# EAGLE design Version 1 (EAGLE 7.3.0)
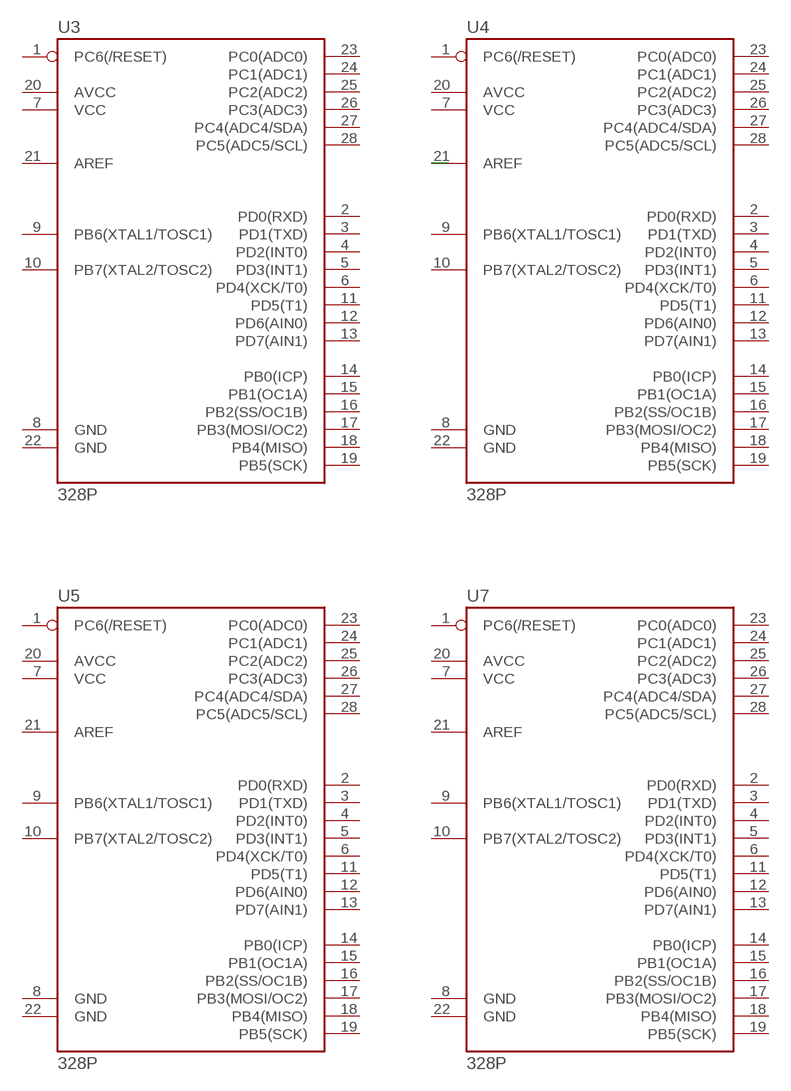
[diagram p0: schematic, sheet 1, part 1 of 2]
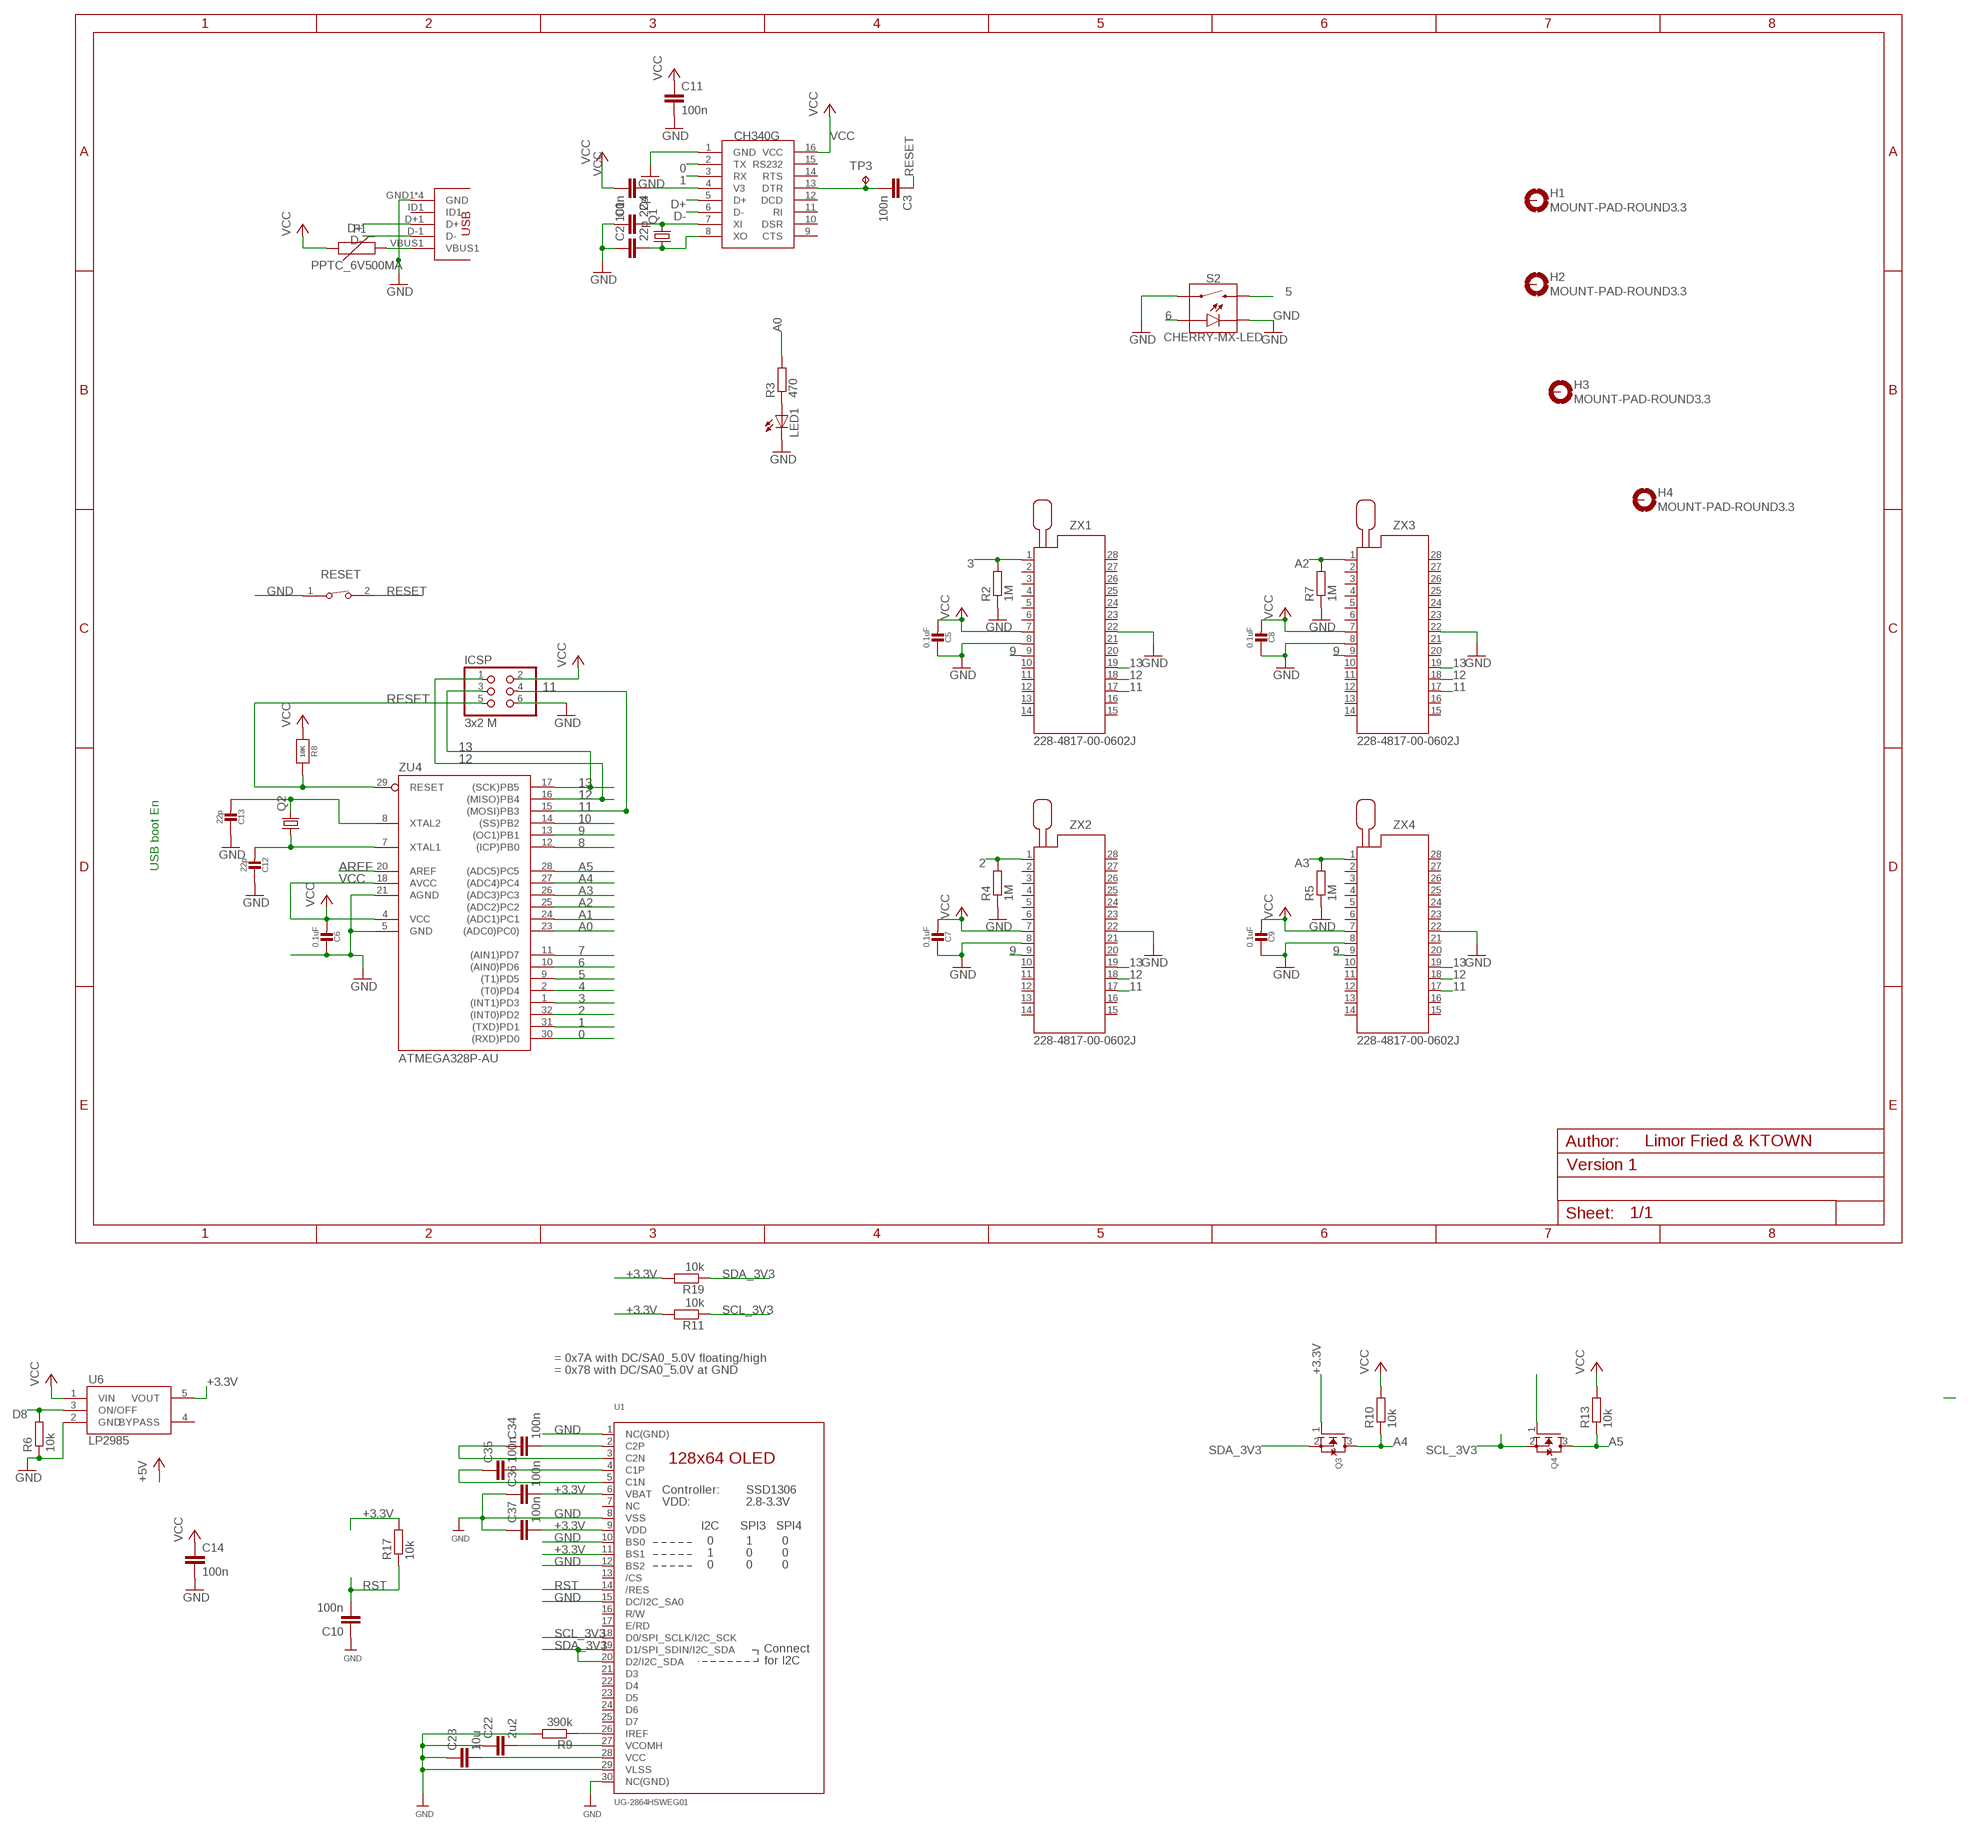
[diagram p1: schematic, sheet 1, part 2 of 2]

## Parts
C1  22p  C-EUC0805  [C0805]
C2  22p  C-EUC0805  [C0805]
C3  100n  C-EUC0805  [C0805]
C4  100n  C-EUC0805  [C0805]
C5  0.1uF  CAP_CERAMIC0805-NOOUTLINE  [0805-NO]
C6  0.1uF  CAP_CERAMIC0805-NOOUTLINE  [0805-NO]
C7  0.1uF  CAP_CERAMIC0805-NOOUTLINE  [0805-NO]
C8  0.1uF  CAP_CERAMIC0805-NOOUTLINE  [0805-NO]
C9  0.1uF  CAP_CERAMIC0805-NOOUTLINE  [0805-NO]
C10  100n  C-EUC0805  [C0805]
C11  100n  C-EUC0805  [C0805]
C12  22p  CAP_CERAMIC0805_10MGAP  [0805_10MGAP]
C13  22p  CAP_CERAMIC0805_10MGAP  [0805_10MGAP]
C14  100n  C-EUC0805  [C0805]
C22  2u2  C-EUC0805  [C0805]
C23  10u  C-EUC0805  [C0805]
C34  100n  C-EUC0805  [C0805]
C35  100n  C-EUC0805  [C0805]
C36  100n  C-EUC0805  [C0805]
C37  100n  C-EUC0805  [C0805]
F1  PPTC_6V500MA  [0805]
H1  MOUNT-PAD-ROUND3.3  [3,3-PAD]
H2  MOUNT-PAD-ROUND3.3  [3,3-PAD]
H3  MOUNT-PAD-ROUND3.3  [3,3-PAD]
H4  MOUNT-PAD-ROUND3.3  [3,3-PAD]
ICSP  3x2 M  HEADER-2X3  [2X03_ROUND_70MIL]
J1  USB-AB  [USB-AB-MICRO-SMD_V02_BOSS]
LED1  LEDCHIPLED_0805  [CHIPLED_0805]
Q1  CRYSTALHC49S  [HC49/S]
Q2  CRYSTALHC49S  [HC49/S]
Q3  MOSFET-NREFLOW  [SOT23]
Q4  MOSFET-NREFLOW  [SOT23]
R2  1M  R-EU_R0805  [R0805]
R3  470  R-EU_R0805  [R0805]
R4  1M  R-EU_R0805  [R0805]
R5  1M  R-EU_R0805  [R0805]
R6  10k  R-EU_R0805  [R0805]
R7  1M  R-EU_R0805  [R0805]
R8  10K  RESISTOR_0805MP  [_0805MP]
R9  390k  R-EU_R0805  [R0805]
R10  10k  R-EU_R0805  [R0805]
R11  10k  R-EU_R0805  [R0805]
R13  10k  R-EU_R0805  [R0805]
R17  10k  R-EU_R0805  [R0805]
R19  10k  R-EU_R0805  [R0805]
RESET  434111043826  [434111043826]
S2  CHERRY-MX-LED  [CHERRY-MX-LED]
TP3  TPTP18R  [TP18R]
U1  UG-2864HSWEG01  DISP_OLED_UG-2864HSWEG010.96"  [UG-2864HSWEG01_0.96IN_WRAPAROUND]
U2  CH340G  [SOIC16]
U3  328P  ATMEGA328P_PDIP  [DIP28]
U4  328P  ATMEGA328P_PDIP  [DIP28]
U5  328P  ATMEGA328P_PDIP  [DIP28]
U6  LP2985AIM5-3.3  [SOT25]
U7  328P  ATMEGA328P_PDIP  [DIP28]
ZU4  ATMEGA328P-AU  [TQFP32-08]
ZX1  228-4817-00-0602J  [228-4817-00-0602J]
ZX2  228-4817-00-0602J  [228-4817-00-0602J]
ZX3  228-4817-00-0602J  [228-4817-00-0602J]
ZX4  228-4817-00-0602J  [228-4817-00-0602J]

## Nets
0: U2.2(TX) ZU4.30((RXD)PD0)
1: U2.3(RX) ZU4.31((TXD)PD1)
2: R4.2 ZU4.32((INT0)PD2) ZX2.1
3: R2.2 ZU4.1((INT1)PD3) ZX1.1
4: ZU4.2((T0)PD4)
5: S2.S2 ZU4.9((T1)PD5)
6: S2.A ZU4.10((AIN0)PD6)
7: ZU4.11((AIN1)PD7)
8: ZU4.12((ICP)PB0)
9: ZU4.13((OC1)PB1) ZX1.9 ZX2.9 ZX3.9 ZX4.9
10: ZU4.14((SS)PB2)
11: ICSP.4 ZU4.15((MOSI)PB3) ZX1.17 ZX2.17 ZX3.17 ZX4.17
12: ICSP.1 ZU4.16((MISO)PB4) ZX1.18 ZX2.18 ZX3.18 ZX4.18
13: ICSP.3 ZU4.17((SCK)PB5) ZX1.19 ZX2.19 ZX3.19 ZX4.19
+3.3V: C36.2 C37.2 Q3.1(G) Q4.1(G) R11.2 R17.2 R19.2 U1.6(VBAT) U1.9(VDD) U1.11(BS1) U6.5(VOUT)
A0: R3.2 ZU4.23((ADC0)PC0))
A1: ZU4.24((ADC1)PC1)
A2: R7.2 ZU4.25((ADC2)PC2) ZX3.1
A3: R5.2 ZU4.26((ADC3)PC3) ZX4.1
A4: Q3.3(D) R10.1 ZU4.27((ADC4)PC4)
A5: Q4.3(D) R13.1 ZU4.28((ADC5)PC5)
AREF [aref]: ZU4.20(AREF)
AREF1: U4.21(AREF)
D8: R6.2 U6.3(ON/OFF)
D+: J1.D+1(D+) U2.5(D+)
D-: J1.D-1(D-) U2.6(D-)
GND [gnd]: C1.1 C2.1 C5.1 C6.1 C7.1 C8.1 C9.1 C10.1 C11.2 C12.1 C13.1 C14.2 C22.1 C23.1 C36.1 C37.1 ICSP.6 J1.GND1(GND) J1.P$1(GND) J1.P$2(GND) J1.P$3(GND) LED1.C R2.1 R4.1 R5.1 R6.1 R7.1 R9.2 RESET.1 S2.K(C) S2.S1 U1.1(NC(GND)) U1.8(VSS) U1.10(BS0) U1.12(BS2) U1.15(DC/I2C_SA0) U1.29(VLSS) U1.30(NC(GND)) U2.1(GND) U6.2(GND) ZU4.5(GND) ZU4.21(AGND) ZX1.8 ZX1.22 ZX2.8 ZX2.22 ZX3.8 ZX3.22 ZX4.8 ZX4.22
N$2: C1.2 Q1.2 U2.7(XI)
N$3: C23.2 U1.28(VCC)
N$4: C2.2 Q1.1 U2.8(XO)
N$5: C3.2 TP3.TP U2.13(DTR)
N$6: C4.1 U2.4(V3)
N$7: LED1.A R3.1
N$10: F1.2 J1.VBUS1
N$11: C34.2 U1.2(C2P)
N$19: C22.2 U1.27(VCOMH)
N$104: R9.1 U1.26(IREF)
N$112: C34.1 U1.3(C2N)
N$113: C35.2 U1.4(C1P)
N$114: C35.1 U1.5(C1N)
RESET: C3.1 ICSP.5 R8.1 RESET.2 ZU4.29(RESET)
RST: C10.2 R17.1 U1.14(/RES)
SCL_3V3: Q4.2(S) R11.1 U1.18(D0/SPI_SCLK/I2C_SCK)
SDA_3V3: Q3.2(S) R19.1 U1.19(D1/SPI_SDIN/I2C_SDA) U1.20(D2/I2C_SDA)
VCC [usbvcc]: C4.2 C5.2 C6.2 C7.2 C8.2 C9.2 C11.1 C14.1 F1.1 ICSP.2 R8.2 R10.2 R13.2 U2.16(VCC) U6.1(VIN) ZU4.4(VCC) ZU4.18(AVCC) ZX1.7 ZX2.7 ZX3.7 ZX4.7
XTAL1: C12.2 Q2.1 ZU4.7(XTAL1)
XTAL2: C13.2 Q2.2 ZU4.8(XTAL2)
Unconnected: H1.B3,3(MOUNT) H2.B3,3(MOUNT) H3.B3,3(MOUNT) H4.B3,3(MOUNT) J1.ID1 U1.7(NC) U1.13(/CS) U1.16(R/W) U1.17(E/RD) U1.21(D3) U1.22(D4) U1.23(D5) U1.24(D6) U1.25(D7) U2.9(CTS) U2.10(DSR) U2.11(RI) U2.12(DCD) U2.14(RTS) U2.15(RS232) U3.1(PC6(/RESET)) U3.2(PD0(RXD)) U3.3(PD1(TXD)) U3.4(PD2(INT0)) U3.5(PD3(INT1)) U3.6(PD4(XCK/T0)) U3.7(VCC) U3.8(GND) U3.9(PB6(XTAL1/TOSC1)) U3.10(PB7(XTAL2/TOSC2)) U3.11(PD5(T1)) U3.12(PD6(AIN0)) U3.13(PD7(AIN1)) U3.14(PB0(ICP)) U3.15(PB1(OC1A)) U3.16(PB2(SS/OC1B)) U3.17(PB3(MOSI/OC2)) U3.18(PB4(MISO)) U3.19(PB5(SCK)) U3.20(AVCC) U3.21(AREF) U3.22(GND) U3.23(PC0(ADC0)) U3.24(PC1(ADC1)) U3.25(PC2(ADC2)) U3.26(PC3(ADC3)) U3.27(PC4(ADC4/SDA)) U3.28(PC5(ADC5/SCL)) U4.1(PC6(/RESET)) U4.2(PD0(RXD)) U4.3(PD1(TXD)) U4.4(PD2(INT0)) U4.5(PD3(INT1)) U4.6(PD4(XCK/T0)) U4.7(VCC) U4.8(GND) U4.9(PB6(XTAL1/TOSC1)) U4.10(PB7(XTAL2/TOSC2)) U4.11(PD5(T1)) U4.12(PD6(AIN0)) U4.13(PD7(AIN1)) U4.14(PB0(ICP)) U4.15(PB1(OC1A)) U4.16(PB2(SS/OC1B)) U4.17(PB3(MOSI/OC2)) U4.18(PB4(MISO)) U4.19(PB5(SCK)) U4.20(AVCC) U4.22(GND) U4.23(PC0(ADC0)) U4.24(PC1(ADC1)) U4.25(PC2(ADC2)) U4.26(PC3(ADC3)) U4.27(PC4(ADC4/SDA)) U4.28(PC5(ADC5/SCL)) U5.1(PC6(/RESET)) U5.2(PD0(RXD)) U5.3(PD1(TXD)) U5.4(PD2(INT0)) U5.5(PD3(INT1)) U5.6(PD4(XCK/T0)) U5.7(VCC) U5.8(GND) U5.9(PB6(XTAL1/TOSC1)) U5.10(PB7(XTAL2/TOSC2)) U5.11(PD5(T1)) U5.12(PD6(AIN0)) U5.13(PD7(AIN1)) U5.14(PB0(ICP)) U5.15(PB1(OC1A)) U5.16(PB2(SS/OC1B)) U5.17(PB3(MOSI/OC2)) U5.18(PB4(MISO)) U5.19(PB5(SCK)) U5.20(AVCC) U5.21(AREF) U5.22(GND) U5.23(PC0(ADC0)) U5.24(PC1(ADC1)) U5.25(PC2(ADC2)) U5.26(PC3(ADC3)) U5.27(PC4(ADC4/SDA)) U5.28(PC5(ADC5/SCL)) U6.4(BYPASS) U7.1(PC6(/RESET)) U7.2(PD0(RXD)) U7.3(PD1(TXD)) U7.4(PD2(INT0)) U7.5(PD3(INT1)) U7.6(PD4(XCK/T0)) U7.7(VCC) U7.8(GND) U7.9(PB6(XTAL1/TOSC1)) U7.10(PB7(XTAL2/TOSC2)) U7.11(PD5(T1)) U7.12(PD6(AIN0)) U7.13(PD7(AIN1)) U7.14(PB0(ICP)) U7.15(PB1(OC1A)) U7.16(PB2(SS/OC1B)) U7.17(PB3(MOSI/OC2)) U7.18(PB4(MISO)) U7.19(PB5(SCK)) U7.20(AVCC) U7.21(AREF) U7.22(GND) U7.23(PC0(ADC0)) U7.24(PC1(ADC1)) U7.25(PC2(ADC2)) U7.26(PC3(ADC3)) U7.27(PC4(ADC4/SDA)) U7.28(PC5(ADC5/SCL)) ZX1.2 ZX1.3 ZX1.4 ZX1.5 ZX1.6 ZX1.10 ZX1.11 ZX1.12 ZX1.13 ZX1.14 ZX1.15 ZX1.16 ZX1.20 ZX1.21 ZX1.23 ZX1.24 ZX1.25 ZX1.26 ZX1.27 ZX1.28 ZX2.2 ZX2.3 ZX2.4 ZX2.5 ZX2.6 ZX2.10 ZX2.11 ZX2.12 ZX2.13 ZX2.14 ZX2.15 ZX2.16 ZX2.20 ZX2.21 ZX2.23 ZX2.24 ZX2.25 ZX2.26 ZX2.27 ZX2.28 ZX3.2 ZX3.3 ZX3.4 ZX3.5 ZX3.6 ZX3.10 ZX3.11 ZX3.12 ZX3.13 ZX3.14 ZX3.15 ZX3.16 ZX3.20 ZX3.21 ZX3.23 ZX3.24 ZX3.25 ZX3.26 ZX3.27 ZX3.28 ZX4.2 ZX4.3 ZX4.4 ZX4.5 ZX4.6 ZX4.10 ZX4.11 ZX4.12 ZX4.13 ZX4.14 ZX4.15 ZX4.16 ZX4.20 ZX4.21 ZX4.23 ZX4.24 ZX4.25 ZX4.26 ZX4.27 ZX4.28

## Notes on the sheet
- USB boot En
- Limor Fried & KTOWN
- = 0x7A with DC/SA0_5.0V floating/high
- = 0x78 with DC/SA0_5.0V at GND

## Library data of the parts
C1-C4 C11 C14 = resistor:C-EU: CAPACITOR, European symbol
C5-C9 C12 C13 = microbuilder:CAP_CERAMIC: Ceramic Capacitors For new designs, use the packages preceded by an '_' character since they are more reliable: The following footprints should be used on most boards: _0402 - Standard footprint for regular board layouts _0603 - Standard footprint for regular board layouts _0805 - Standard footprint for regular board layouts _1206 - Standard footprint for regular board layouts For extremely tight-pitch boards where space is at a premium, the following 'micro-pitch' footprints can be used (smaller pads, no silkscreen outline, etc.): _0402MP - Micro-pitch footprint for very dense/compact boards _0603MP - Micro-pitch footprint for very dense/compact boards _0805MP - Micro-pitch footprint for very dense/compact boards _1206MP - Micro-pitch footprint for very dense/compact boards
C10 C22 C23 C34-C37 = rcl:C-EU: CAPACITOR, European symbol
F1 = SparkFun-Fuses:PPTC: Resettable Fuse PPTC Resettable Fuse. Really a sort of resistor with a polymeric positive temperature coefficient whose resistance increases dramatically with an increase in temperature. When heated by the power passing through the resistance rises causing the current to be limited, protecting the circuit. This is achieved by the transition of the polymer from a crystalline to an amorphous state where the conductive carbon separates breaking the conductive pathways found in the cool crystalline structure. When a PPTC cools back down it resumes conducting letting the circuit turn back on. SparkFun Products: SparkFun RedBoard - Programmed with Arduino <https://www.sparkfun.com/products/12757> Pro Micro - 5V/16MHz <https://www.sparkfun.com/products/12640> Arduino Pro 328 - 5V/16MHz <https://www.sparkfun.com/products/10915> MP3 Trigger <https://www.sparkfun.com/products/13720>
H1-H4 = holes:MOUNT-PAD-ROUND: MOUNTING PAD, round
ICSP = microbuilder:HEADER-2X3: PIN HEADER
J1 = Testing:USB-AB
LED1 = adafruit:LED: LED OSRAM: - CHIPLED LG R971, LG N971, LY N971, LG Q971, LY Q971, LO R971, LY R971 LH N974, LH R974 LS Q976, LO Q976, LY Q976 LO Q996 - Hyper CHIPLED LW Q18S LB Q993, LB Q99A, LB R99A - SideLED LS A670, LO A670, LY A670, LG A670, LP A670 LB A673, LV A673, LT A673, LW A673 LH A674 LY A675 LS A676, LA A676, LO A676, LY A676, LW A676 LS A679, LY A679, LG A679 - Hyper Micro SIDELED® LS Y876, LA Y876, LO Y876, LY Y876 LT Y87S - SmartLED LW L88C, LW L88S LB L89C, LB L89S, LG L890 LS L89K, LO L89K, LY L89K LS L896, LA L896, LO L896, LY L896 - TOPLED LS T670, LO T670, LY T670, LG T670, LP T670 LSG T670, LSP T670, LSY T670, LOP T670, LYG T670 LG T671, LOG T671, LSG T671 LB T673, LV T673, LT T673, LW T673 LH T674 LS T676, LA T676, LO T676, LY T676, LB T676, LH T676, LSB T676, LW T676 LB T67C, LV T67C, LT T67C, LS T67K, LO T67K, LY T67K, LW E67C LS E67B, LA E67B, LO E67B, LY E67B, LB E67C, LV E67C, LT E67C LW T67C LS T679, LY T679, LG T679 LS T770, LO T770, LY T770, LG T770, LP T770 LB T773, LV T773, LT T773, LW T773 LH T774 LS E675, LA E675, LY E675, LS T675 LS T776, LA T776, LO T776, LY T776, LB T776 LHGB T686 LT T68C, LB T68C - Hyper Mini TOPLED® LB M676 - Mini TOPLED Santana® LG M470 LS M47K, LO M47K, LY M47K Source: http://www.osram.convergy.de/
Q1 Q2 = adafruit:CRYSTAL: CRYSTAL; OC_FARNELL: 1667008; OC_NEWARK: unknown
Q3 Q4 = adafruit:MOSFET-N: N-Channel Mosfet 2N7002E - 60V 260mA SOT23 [Digikey: 2N7002ET1GOSTR-ND] - REEL BSH103 - 30V 850mA SOT23 [Digikey: 568-5013-1-ND]
R2-R5 R7 = resistor:R-EU_: RESISTOR, European symbol
R6 R9-R11 R13 R17 R19 = rcl:R-EU_: RESISTOR, European symbol
R8 = microbuilder:RESISTOR: Resistors 0402 - 0402 Surface Mount Package 22 Ohm 1% 1/16W [Digikey: 311-22.0LRTR-ND] 33 Ohm 5% 1/16W 1.0K 5% 1/16W 1.5K 5% 1/16W 2.0K 1% 1/16W 10.0K 1% 1/16W [Digikey: 311-10.0KLRTR-ND] 10.0K 5% 1/16W [Digikey: RMCF0402JT10K0TR-ND] 12.1K 1% 1/16W [Digikey: 311-22.0LRTR-ND] 100.0K 5% 1/16W 0603 - 0603 Surface Mount Package 0 Ohm 1/10 Watt 1% Resistor 15 Ohm 1/10 Watt 1% Resistor 33 Ohm 1/10 Watt 1% Resistor 49.9 Ohm 1/10 Watt 1% Resistor 100 Ohm 1/10 Watt 1% Resistor 150 Ohm 1/10 Watt 1% Resistor 240 Ohm 1/10 Watt 1% Resistor 390 Ohm 1/10 Watt 1% Resistor 560 Ohm 1/10 Watt 1% Resistor 680 Ohm 1/10 Watt 1% Resistor 750 Ohm 1/10 Watt 1% Resistor 1.0K Ohm 1/10 Watt 1% Resistor 1.5K Ohm 1/10 Watt 1% Resistor 2.0K Ohm 1/10 Watt 1% Resistor 2.2K Ohm 1/10 Watt 1% Resistor 3.3K Ohm 1/10 Watt 1% Resistor 4.7K Ohm 1/10 Watt 1% Resistor 10.0K Ohm 1/10 Watt 1% Resistor 12.0K Ohm 1/10 Watt 1% Resistor 12.1K Ohm 1/10 Watt 1% Resistor 20.0K Ohm 1/10 Watt 1% Resistor 33.0K Ohm 1/10 Watt 1% Resistor 100.0K Ohm 1/10 Watt 1% Resistor 0805 - 0805 Surface Mount Package 0 Ohm 1/8 Watt 1% Resistor 33 Ohm 1/8 Watt 1% Resistor 100 Ohm 1/8 Watt 1% Resistor 150 Ohm 1/8 Watt 1% Resistor 200 Ohm 1/8 Watt 1% Resistor 240 Ohm 1/8 Watt 1% Resistor 330 Ohm 1/8 Watt 1% Resistor 390 Ohm 1/8 Watt 1% Resistor 470 Ohm 1/8 Watt 1% Resistor 1.0K Ohm 1/8 Watt 1% Resistor 1.5K Ohm 1/8 Watt 1% Resistor 2.0K Ohm 1/8 Watt 1% Resistor 4.7K Ohm 1/8 Watt 1% Resistor 5.1K Ohm 1/8 Watt 1% Resistor 5.6K Ohm 1/8 Watt 1% Resistor 10.0K Ohm 1/8 Watt 1% Resistor 22.0K Ohm 1/8 Watt 1% Resistor 33.0K Ohm 1/8 Watt 1% Resistor 100K Ohm 1/8 Watt 1% Resistor 1206 - 1206 Surface Mount Package 2012 - 2010 Surface Mount Package 0.11 Ohm 1/2 Watt 1% Resistor - Digikey: RHM.11UCT-ND
RESET = Eagle_SWITCHES (rev18c):434111043826: 6.0x3.5 mm SMD WS-TASV <http://katalog.we-online.de/media/images/v2/Family_WS-TASV_6.0x3.jpg> Details see: http://katalog.we-online.de/em/datasheet/4341x1xxx8x6.pdf 2015 (C) Wurth Elektronik
S2 = SparkFun-Electromechanical2:CHERRY-MX-LED: Cherry MX Switch - Electromechanical Swith w/ LED Cherry MX Keyswitches are top-of-the-line mechanical keyboard switches. They’re satisfyingly “clicky”, reliable up to tens-of-millions of key presses, and a standard in gaming and programming keyboards across the globe. This ‘blue’ version Cherry MX Switch is favored by most due to its secondary internal actuator making it less likely to “double-tap.” If you are looking for a noticeably audible and high-quality key switch, this is the perfect option for you! SparkFun Product Link <https://www.sparkfun.com/products/13834>; SF_ID: COM-13834
TP3 = testpad:TP: Test pad
U1 = microbuilder:DISP_OLED_UG-2864HSWEG01: UG-2864HSWEG01 OLED display Both 1.3" and 0.96" models share the same FPC tab footprint, only the screen dimensions vary.
U2 = ch340g:CH340G
U3-U5 U7 = SparkFun-IC-Microcontroller:ATMEGA328P_PDIP: Atmel 328P Through hole ATMEGA328P uC used in the Arduino 32kb flash, 1k EEPROM, 2k SRAM Datasheet <http://www.sparkfun.com/datasheets/Components/SMD/ATMega328.pdf> SparkFun Products Storefront component: AVR 28 Pin 20MHz 32K 6A/D - ATMega328P <https://www.sparkfun.com/products/9061> (COM-09061) SparkFun Simon Says - Through-Hole Soldering Kit <https://www.sparkfun.com/products/10547> (KIT-10547) SparkFun Learn to Solder - Simon Says <https://www.sparkfun.com/products/13708> (KIT-13708) SparkFun BigTime Watch Kit <https://www.sparkfun.com/products/11734> (KIT-11734) SparkFun ClockIt <https://www.sparkfun.com/products/10930> (KIT-10930) SparkFun Serial Enabled LCD Kit <https://www.sparkfun.com/products/10097> (LCD-10097) SparkFun Simon Tilts - Through Hole Soldering Kit <https://www.sparkfun.com/products/12634> (KIT-12634) SparkFun Frequency Counter Kit <https://www.sparkfun.com/products/10140> (KIT-10140) FabFM Radio Kit <https://www.sparkfun.com/products/11043> (KIT-11043) SparkFun Binary Blaster Kit <https://www.sparkfun.com/products/12037> (KIT-12037) SparkFun Metro-Gnome <https://www.sparkfun.com/products/9236> (KIT-09236) ATmega328 with Arduino Optiboot (Uno) <https://www.sparkfun.com/products/10524> (DEV-10524); PROD_ID: IC-09136
U6 = LP2985:LP2985: LP2985-N Micropower 150 mA Low-Noise Ultra Low-Dropout Regulator
ZU4 = SmartPrj:ATMEGA328P-: MICROCONTROLLER 4 Kbytes FLASH 128 bytes SRAM 256 bytes EEPROM UART 6-channel 10 bit ADC
ZX1-ZX4 = con-3m:228-?00-0602J: Zero Insertion Force Socked Source: http://www.3M.com/ehpd; MF: 3M; MPN: 228-4817-00-0602J; OC_FARNELL: 1252775; OC_NEWARK: 85K7834

## Net classes
0 default: clearance 0.205 mm
1 power: width 0.305 mm, drill 0.483 mm, clearance 0.203 mm
2 gnd: width 0.305 mm, drill 0.483 mm, clearance 0.203 mm
3 usbvcc: width 0.305 mm, drill 0.483 mm, clearance 0.203 mm
4 aref: width 0.254 mm, drill 0.483 mm, clearance 0.203 mm

## Board
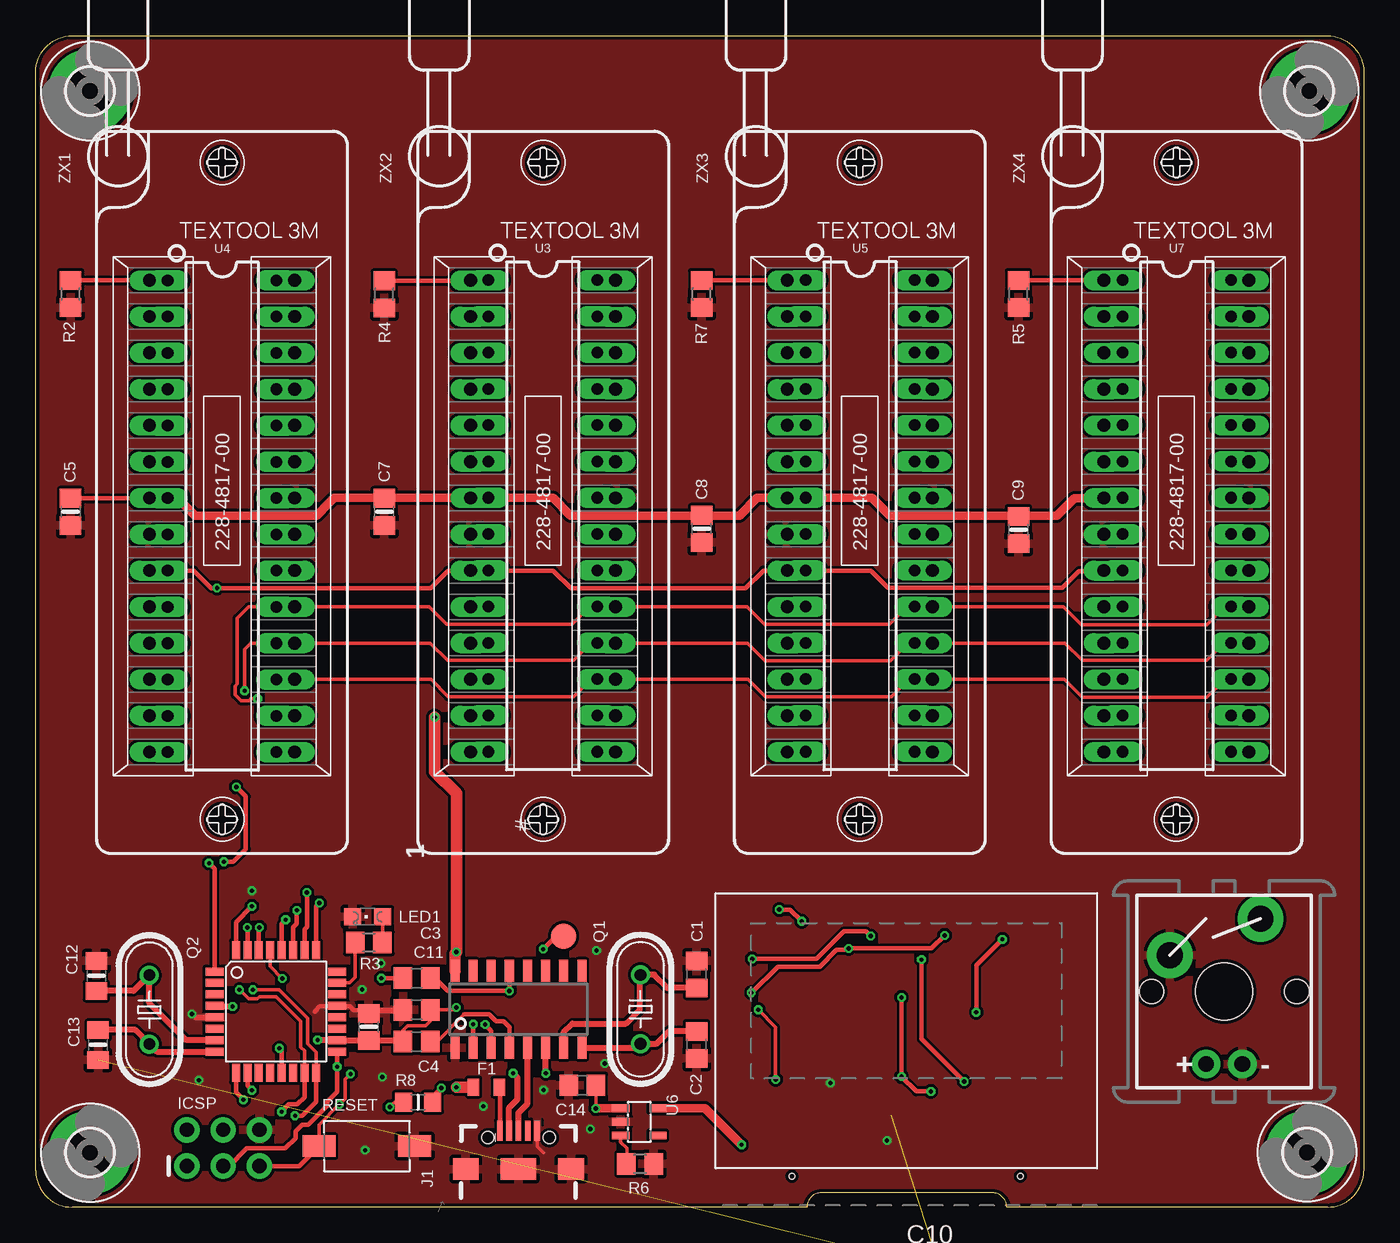
[diagram p2: board, top side]
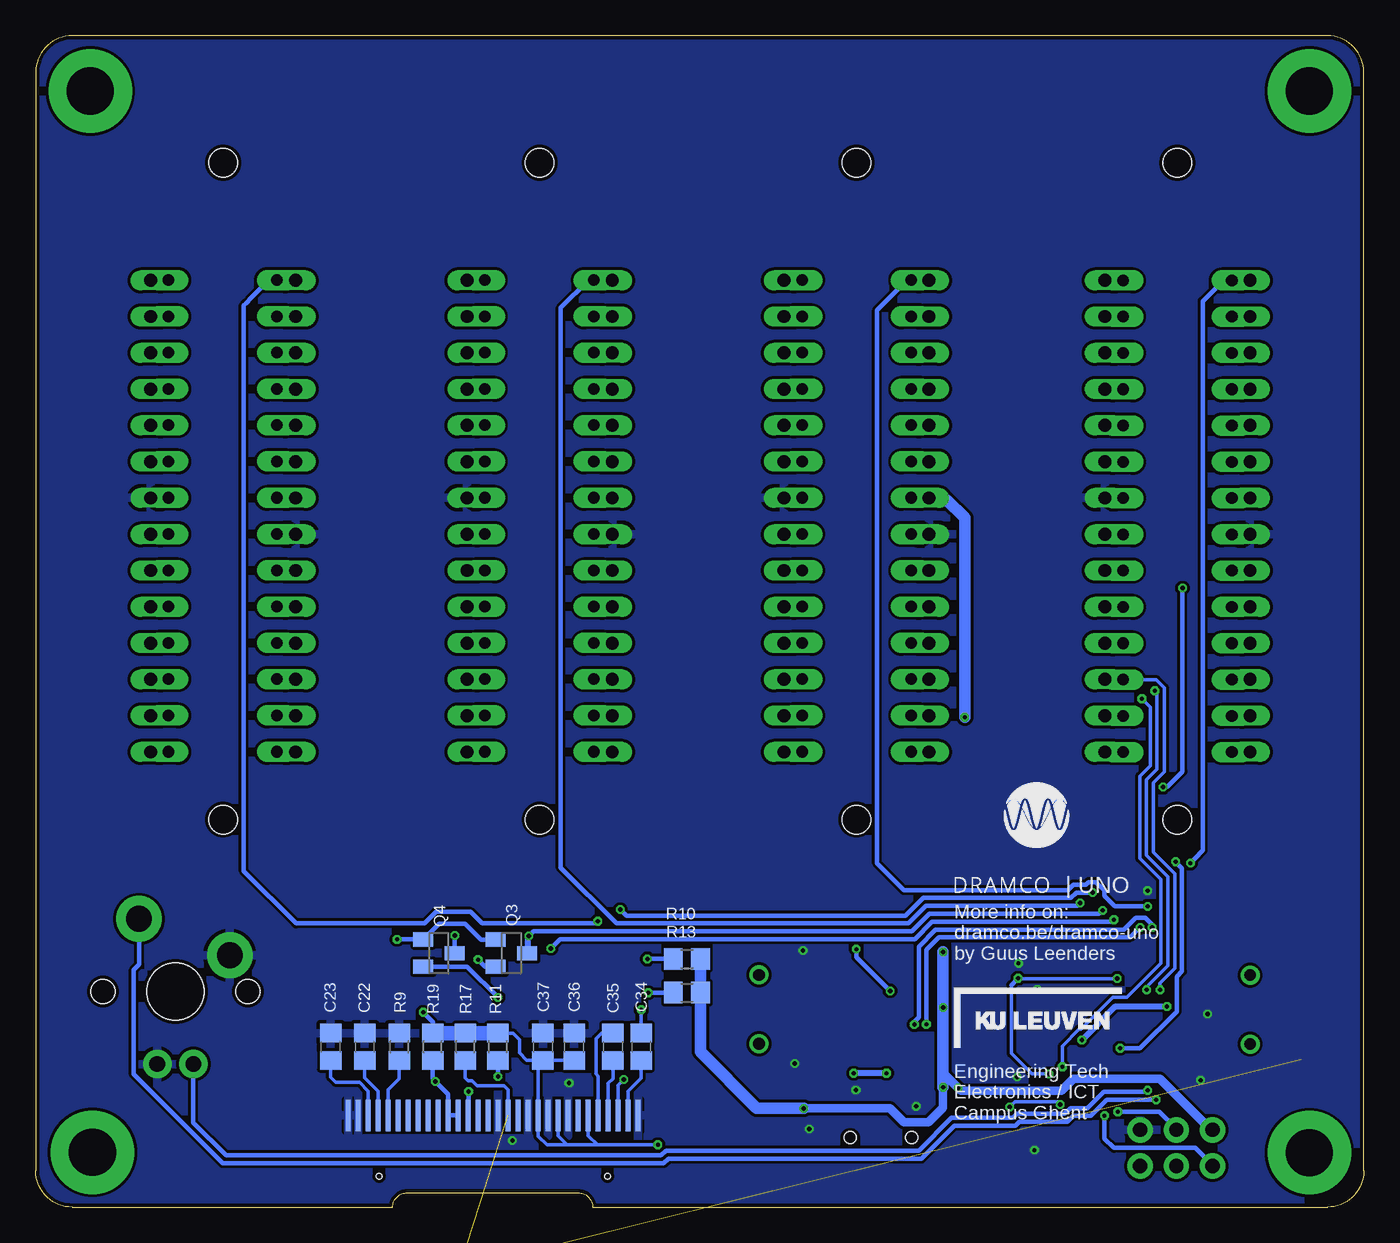
[diagram p3: board, bottom side, seen from below]

Size 93 x 82 mm. Coordinates in mm from the lower left corner, seen from the top.
Outline: 0,2.54 0,79.46 arc-90 2.54,82 90.46,82 arc-90 93,79.46 93,2.54 arc-90 90.46,0 68,0 arc90 67,1 55,1 arc90 54,0 2.54,0 arc-90 0,2.54
Copper layers (1*16): Top 0.035mm / dielectric 1.5mm / Bottom 0.035mm
Design rules "SeeedStudio_2layer_DRU_no_angle_20140221": minimum track width 6mil, minimum drill 12mil, track to track 6mil, track to pad 6mil, pad to pad 6mil, via to via 6mil, smd to smd 0mil, copper to edge 10mil, drill to drill 10mil, minimum pad ring 10mil, minimum via ring 6mil, stop-mask expansion 2mil, vias tented up to drill 100mil, thermal gap 10mil

### Footprints (pad centres in the part's own frame; a part is rotated, then mirrored left to right if it is on the bottom)
C0805 = smd 1.3 x 1.5: 1 -0.95,0; 2 0.95,0
0805-NO = smd 1.3 x 1.5: 1 -0.95,0; 2 0.95,0
0805_10MGAP = smd 1.2 x 1.5: 1 -1.05,0; 2 1.05,0
0805 = smd 0.8 x 1.2: 1 -0.9,0; 2 0.9,0
3,3-PAD = drill 3.3 pad 5.842: B3,3 0,0
2X03_ROUND_70MIL = drill 1 pad 1.778: 1 -2.54,-1.27; 2 -2.54,1.27; 3 0,-1.27; 4 0,1.27; 5 2.54,-1.27; 6 2.54,1.27
USB-AB-MICRO-SMD_V02_BOSS = smd 1.4 x 0.4: D+1 2.7,0; D-1 2.7,0.65; GND1 2.7,-1.3; ID1 2.7,-0.65; VBUS1 2.7,1.3 | smd 1.5 x 2.5: P$1 0,0 | smd 1.5 x 1.8: P$2 0,-3.683; P$3 0,3.683 | hole 0.85: 2.2,2.154; 2.2,-2.154
CHIPLED_0805 = smd 1.2 x 1.2: A 0,-1.05; C 0,1.05
HC49/S = drill 0.813: 1 -2.413,0; 2 2.413,0
SOT23 = smd 1 x 1.4: 1 -0.95,-1.1; 2 0.95,-1.1; 3 0,1.1
R0805 = smd 1.3 x 1.5: 1 -0.95,0; 2 0.95,0
_0805MP = smd 1.2 x 1.3: 1 -1.016,0; 2 1.016,0
434111043826 = smd 2.3 x 1.5: 1 -3.35,0; 2 3.35,0
CHERRY-MX-LED = drill 1.1 pad 2: A -1.27,-5.08; K 1.27,-5.08 | drill 1.8 pad 3.2: S1 -3.81,2.54; S2 2.54,5.08 | hole 4: 0,0 | hole 1.7: -5.08,0; 5.08,0
TP18R = smd 1.8 x 1.8: TP 0,0
UG-2864HSWEG01_0.96IN_WRAPAROUND = smd 0.35 x 2.2 bottom: 1 -10.15,-1.2; 2 -9.45,-1.2; 3 -8.75,-1.2; 4 -8.05,-1.2; 5 -7.35,-1.2; 6 -6.65,-1.2; 7 -5.95,-1.2; 8 -5.25,-1.2; 9 -4.55,-1.2; 10 -3.85,-1.2; 11 -3.15,-1.2; 12 -2.45,-1.2; 13 -1.75,-1.2; 14 -1.05,-1.2; 15 -0.35,-1.2; 16 0.35,-1.2; 17 1.05,-1.2; 18 1.75,-1.2; 19 2.45,-1.2; 20 3.15,-1.2; 21 3.85,-1.2; 22 4.55,-1.2; 23 5.25,-1.2; 24 5.95,-1.2; 25 6.65,-1.2; 26 7.35,-1.2; 27 8.05,-1.2; 28 8.75,-1.2; 29 9.45,-1.2; 30 10.15,-1.2 | hole 0.4: -8,-5.45; 8,-5.45
SOIC16 = smd 0.635 x 1.524: 1 -4.445,-2.695; 2 -3.175,-2.695; 3 -1.905,-2.695; 4 -0.635,-2.695; 5 0.635,-2.695; 6 1.905,-2.695; 7 3.175,-2.695; 8 4.445,-2.695; 9 4.445,2.695; 10 3.175,2.695; 11 1.905,2.695; 12 0.635,2.695; 13 -0.635,2.695; 14 -1.905,2.695; 15 -3.175,2.695; 16 -4.445,2.695
DIP28 = drill 0.813 pad 1.422 long: 1 -16.51,-3.81; 2 -13.97,-3.81; 3 -11.43,-3.81; 4 -8.89,-3.81; 5 -6.35,-3.81; 6 -3.81,-3.81; 7 -1.27,-3.81; 8 1.27,-3.81; 9 3.81,-3.81; 10 6.35,-3.81; 11 8.89,-3.81; 12 11.43,-3.81; 13 13.97,-3.81; 14 16.51,-3.81; 15 16.51,3.81; 16 13.97,3.81; 17 11.43,3.81; 18 8.89,3.81; 19 6.35,3.81; 20 3.81,3.81; 21 1.27,3.81; 22 -1.27,3.81; 23 -3.81,3.81; 24 -6.35,3.81; 25 -8.89,3.81; 26 -11.43,3.81; 27 -13.97,3.81; 28 -16.51,3.81
SOT25 = smd 0.55 x 1.2: 1 -0.95,-1.3; 2 0,-1.3; 3 0.95,-1.3; 4 0.95,1.3; 5 -0.95,1.3
TQFP32-08 = smd 1.27 x 0.559: 1 -4.293,2.8; 2 -4.293,2; 3 -4.293,1.2; 4 -4.293,0.4; 5 -4.293,-0.4; 6 -4.293,-1.2; 7 -4.293,-2; 8 -4.293,-2.8; 17 4.293,-2.8; 18 4.293,-2; 19 4.293,-1.2; 20 4.293,-0.4; 21 4.293,0.4; 22 4.293,1.2; 23 4.293,2; 24 4.293,2.8 | smd 0.559 x 1.27: 9 -2.8,-4.293; 10 -2,-4.293; 11 -1.2,-4.293; 12 -0.4,-4.293; 13 0.4,-4.293; 14 1.2,-4.293; 15 2,-4.293; 16 2.8,-4.293; 25 2.8,4.293; 26 2,4.293; 27 1.2,4.293; 28 0.4,4.293; 29 -0.4,4.293; 30 -1.2,4.293; 31 -2,4.293; 32 -2.8,4.293
228-4817-00-0602J = drill 0.9 long: 1 -16.51,-5.08; 2 -13.97,-5.08; 3 -11.43,-5.08; 4 -8.89,-5.08; 5 -6.35,-5.08; 6 -3.81,-5.08; 7 -1.27,-5.08; 8 1.27,-5.08; 9 3.81,-5.08; 10 6.35,-5.08; 11 8.89,-5.08; 12 11.43,-5.08; 13 13.97,-5.08; 14 16.51,-5.08; 15 16.51,5.08; 16 13.97,5.08; 17 11.43,5.08; 18 8.89,5.08; 19 6.35,5.08; 20 3.81,5.08; 21 1.27,5.08; 22 -1.27,5.08; 23 -3.81,5.08; 24 -6.35,5.08; 25 -8.89,5.08; 26 -11.43,5.08; 27 -13.97,5.08; 28 -16.51,5.08 | hole 2: 21.24,0; -24.74,0

### Placement (x,y rotation side)
C1  46.28,16.29 270 top
C2  46.28,11.36 90 top
C3  26.67,16.03 0 top
C4  26.67,11.59 180 top
C5  2.44,48.67 90 top
C6  23.32,12.61 270 top
C7  24.4,48.67 90 top
C8  46.63,47.48 90 top
C9  68.82,47.41 90 top
C10  62.23,-3.81 0 top  (outside the outline)
C11  26.67,13.81 180 top
C12  4.25,16.18 270 top
C13  4.36,11.35 90 top
C14  38.28,8.53 180 top
C22  69.95,11.23 270 bottom
C23  72.34,11.23 270 bottom
C34  50.6,11.23 270 bottom
C35  52.58,11.23 270 bottom
C36  55.3,11.23 270 bottom
C37  57.48,11.23 270 bottom
F1  31.55,8.4 0 top
H1  89.03,3.84 0 top
H2  3.81,78.13 0 top
H3  89.18,78.13 0 top
H4  3.81,3.81 0 top
ICSP  13.13,4.14 0 top
J1  33.8,2.66 90 top
LED1  23.24,20.33 90 top
Q1  42.35,13.85 90 top
Q2  7.96,13.82 270 top
Q3  59.69,17.78 270 bottom
Q4  64.77,17.78 270 bottom
R2  2.44,63.92 90 top
R3  23.33,18.52 180 top
R4  24.4,63.9 90 top
R5  68.82,63.92 90 top
R6  42.32,3.02 180 top
R7  46.63,63.92 90 top
R8  26.77,7.34 0 top
R9  67.54,11.23 90 bottom
R10  47.4,17.37 0 bottom
R11  60.63,11.23 90 bottom
R13  47.4,15.01 0 bottom
R17  62.92,11.23 90 bottom
R19  65.2,11.23 90 bottom
RESET  23.19,4.27 180 top
S2  83.22,15.1 0 top
TP3  36.95,18.95 0 top
U1  60.96,7.62 0 top
U2  33.8,13.85 0 top
U3  35.51,48.39 270 top
U4  13.06,48.36 270 top
U5  57.73,48.39 270 top
U6  42.27,5.97 270 top
U7  79.91,48.39 270 top
ZU4  16.83,13.69 0 top
ZX1  13.05,48.37 270 top
ZX2  35.53,48.37 270 top
ZX3  57.7,48.37 270 top
ZX4  79.88,48.37 270 top

### Tracks (layer width: path | path; a pad name or v marks a point on that pad's centre or on a via)
0  (via drill 0.3)
  Top 0.305: U2.2 v30.62,12.79 v30.63,12.8 | ZU4.30 15.62,19.53 v15.67,19.58
  Bottom 0.305: v30.63,12.8 30.63,18.01 29.74,18.9 16.36,18.9 v15.67,19.58
1  (via drill 0.3)
  Top 0.305: U2.3 31.89,12.35 v31.47,12.78 | v14.83,19.58 ZU4.31
  Bottom 0.305: v31.47,12.78 31.47,12.98 31.17,13.28 31.17,18.24 30,19.41 29.57,19.41 29.54,19.43 16.84,19.43 16.82,19.41 15.95,20.27 15.29,20.27 14.83,19.81 v14.83,19.58
2  (via drill 0.3)
  Top 0.305: ZU4.32 14.03,19.94 v15.14,21.06 | R4.2 30.42,64.85 ZX2.1
  Bottom 0.305: v15.14,21.06 17.42,21.06 18.16,21.79 18.16,22.17 18.75,22.76 19.28,22.76 19.46,22.58 20.34,22.58 20.73,22.2 32.21,22.2 34.09,24.08 34.09,62.79 33.43,63.45 33.07,63.8 32.03,64.85 30.49,64.85 ZX2.1
3  (via drill 0.3)
  Top 0.305: ZU4.1 12.53,23.69 v12.14,24.08 | R2.2 ZX1.1
  Bottom 0.305: v12.14,24.08 11.56,24.66 11.56,24.69 11.28,24.97 11.28,63.42 9.8,64.9 7.98,64.9 ZX1.1
5  (via drill 0.3)
  Top 0.305: ZU4.9 14.03,8.05 v14.55,7.52
  Bottom 0.305: v14.55,7.52 18.01,7.52 19.13,6.4 20.34,6.4 20.75,5.99 24.11,5.99 24.38,5.71 28.65,5.71 30.96,3.4 48.69,3.4 49.02,3.07 79.91,3.07 86.13,9.3 86.13,16.61 85.75,16.99 S2.S2
6  (via drill 0.3)
  Top 0.305: ZU4.10 14.83,8.49 v15.14,8.18
  Bottom 0.305: v15.14,8.18 15.24,8.08 18.21,8.08 19.36,6.93 20.55,6.93 20.95,6.53 24.31,6.53 24.59,6.25 28.88,6.25 31.17,3.96 48.87,3.96 49.2,3.63 79.68,3.63 81.97,5.92 81.97,10 S2.A
9  (via drill 0.3)
  Top 0.305: ZU4.13 17.23,10.97 v17.07,11.12 | v13.18,24.18 13.82,24.18 14.71,25.07 14.71,28.75 v14.05,29.41 | ZX1.9 11.07,44.55 12.29,43.33 v12.7,43.33 27.64,43.33 28.86,44.56 ZX2.9 36.24,44.56 37.49,43.31 49.71,43.31 50.95,44.55 ZX3.9 58.49,44.56 59.69,43.36 71.88,43.36 73.05,44.53 74.76,44.53 ZX4.9
  Bottom 0.305: v17.07,11.12 15.67,11.12 13.11,13.69 13.11,16.13 12.72,16.51 12.72,23.72 v13.18,24.18 | ZX1.9 | v14.05,29.41 13.77,29.41 12.7,30.48 v12.7,43.33
11  (via drill 0.3)
  Top 0.254: ZU4.15 18.83,10.94 18.57,11.2 18.57,13.01 16.84,14.73 15.67,14.73 15.52,14.58 14.91,14.58 v14.28,15.21 | ZX1.17 27.68,36.94 28.88,35.74 37.67,35.74 38.86,36.93 ZX2.17 49.88,36.94 51.1,35.71 59.92,35.71 61.14,36.93 ZX3.17 72.03,36.94 73.28,35.69 82.02,35.69 83.26,36.93 84.95,36.93 ZX4.17
  Top 0.305: ICSP.4 13.13,5.43 | ZU4.15 18.82,7.7 18.31,7.19 17.73,7.19 v17.22,6.68
  Bottom 0.254: v14.28,15.21 14.28,15.67 13.23,16.71 13.23,23.34 14.73,24.84 14.73,29.72 13.97,30.48 13.97,36.37 14.53,36.93 18.12,36.93 ZX1.17
  Bottom 0.305: v17.22,6.68 14.3,6.68 13.13,5.51 ICSP.4
12  (via drill 0.3)
  Top 0.254: ZU4.16 19.63,10.85 19.05,11.43 19.05,13.21 17.04,15.21 v15.21,15.21 | ZX4.18 84.95,39.47 83.19,39.47 81.99,38.28 73.28,38.28 72.08,39.48 ZX3.18 61.06,39.47 59.84,38.25 51.05,38.25 49.83,39.48 ZX2.18 40.6,39.5 38.89,39.5 37.67,38.28 28.83,38.28 27.63,39.48 ZX1.18 18.12,39.47 15.04,39.47 14.63,39.06 v14.63,36.14
  Top 0.305: v18.16,6.4 18.64,6.4 19.63,7.39 ZU4.16
  Bottom 0.254: v15.21,15.21 15.21,15.39 13.72,16.89 13.72,23.14 15.21,24.64 15.21,29.92 14.48,30.66 14.48,35.99 v14.63,36.14
  Bottom 0.305: ICSP.1 10.59,2.92 11.81,4.14 17.5,4.14 18.16,4.8 v18.16,6.4
13  (via drill 0.3)
  Top 0.254: ZU4.17 v21.12,9.84 v21.11,9.83 | ZX4.19 84.95,42.01 83.24,42.01 81.99,40.77 73.23,40.77 71.97,42.02 ZX3.19 61.01,42.01 59.79,40.79 51.03,40.79 49.8,42.02 ZX2.19 38.76,42.01 37.54,40.79 28.78,40.79 27.55,42.02 ZX1.19 18.12,42.01 14.91,42.01 14.12,41.22 14.12,36.63 13.97,36.47 13.97,35.87 14.38,35.46 14.94,35.46 15.06,35.59 v15.54,35.59
  Top 0.305: ICSP.3 13.54,2.87 14.78,4.12 17.48,4.12 18.19,4.83 18.19,5.31 18.64,5.77 19.07,5.77 20.42,7.11 20.42,7.39 21.11,8.08 v21.11,9.83 21.11,10.88 ZU4.17
  Bottom 0.254: v21.11,9.83 21.11,11.28 19.94,12.45 19.81,12.45 17.58,14.68 16.59,14.68 14.2,17.07 14.2,22.94 15.7,24.43 15.7,30.15 14.96,30.89 14.96,35 v15.54,35.59 | 16.64,42.01 18.12,42.01 ZX1.19
+3.3V  (via drill 0.3)
  Top 0.305: v65.86,13.64 65.86,16.92 v67.69,18.75
  Top 0.61: U6.5 46.88,6.92 v49.43,4.37
  Bottom 0.254: v49.43,4.37 53.67,4.37 | 53.67,4.37 55.78,4.37 | 55.78,4.37 57.2,4.37 57.81,4.98 U1.11 | U1.11 | U1.9 56.41,5 55.78,4.37 | U1.6 54.31,5.01 53.67,4.37 | U1.11 57.81,9.95 C37.2 | C36.2 C37.2 | R11.2 59.57,12.18 59.13,11.73 59.13,10.79 58.62,10.29 C37.2
  Bottom 0.305: R11.2 65.11,12.18 65.18,12.12 65.18,12.95 v65.86,13.64 | v67.69,18.75 65.89,18.75 Q4.1 64.76,19.84 62.92,19.84 61.81,18.73 Q3.1
  Bottom 1.016: R11.2 R17.2 R19.2
A0
  Top 0.254: ZU4.23 21.97,15.69 22.38,16.1 R3.2
A2  (via drill 0.3)
  Top 0.305: ZU4.25 19.63,21.05 v19.86,21.29 | R7.2 ZX3.1
  Bottom 0.305: v19.86,21.29 20.07,21.08 30.66,21.08 31.88,19.86 52.32,19.86 56.24,23.77 56.24,62.94 54.28,64.9 52.64,64.9 ZX3.1
A3  (via drill 0.3)
  Top 0.305: ZU4.26 18.83,19.46 19,19.63 v19,22.02 | v52.07,20.83 52.83,20.83 v53.65,20.02 | R5.2 ZX4.1
  Bottom 0.305: v19,22.02 20.14,22.02 20.52,21.64 30.84,21.64 32.08,20.4 51.64,20.4 v52.07,20.83 | v53.65,20.02 53.8,19.86 61.75,19.86 62.56,20.68 64.97,20.68 65.76,19.89 74.75,19.89 74.78,19.86 78.44,23.52 78.44,63.12 78.31,63.25 77.83,63.73 76.66,64.9 74.81,64.9 ZX4.1
A4  (via drill 0.3)
  Top 0.305: ZU4.27 18.03,19.57 18.29,19.84 v18.29,20.78 | v50.16,17.37 54.66,17.37 56.59,19.3 58.14,19.3 v58.47,18.97
  Bottom 0.305: v18.29,20.78 18.54,20.52 30.43,20.52 31.65,19.3 58.14,19.3 v58.47,18.97 | R10.1 v50.16,17.37 | v58.47,18.97 58.6,18.85 Q3.3 58.47,17.9 v58.47,18.97
A5  (via drill 0.3)
  Top 0.305: ZU4.28 17.23,19.84 v17.5,20.12 | v63.65,19.02 62.74,18.11 v56.92,18.11 56.82,18.01 56.08,18.01 54.91,16.84 51.97,16.84 50.14,15.01 v50.11,15.01
  Bottom 0.305: v17.5,20.12 17.65,19.96 30.23,19.96 31.45,18.75 56.29,18.75 v56.92,18.11 | v63.65,19.02 63.65,17.8 Q4.3 | R13.1 v50.11,15.01
D8
  Top 0.254: U6.3 40.97,4.55 41.4,4.12 41.4,3.06 R6.2
D+
  Top 0.406: J1.D+1 33.8,6.6 34.44,7.24 34.44,11.15 U2.5
D-  (via drill 0.3)
  Top 0.406: J1.D-1 33.15,6.96 33.73,7.54 33.73,9.07 v33.43,9.37 | v35.71,9.37 35.71,11.15 U2.6
  Bottom 0.406: v33.43,9.37 v35.71,9.37
GND  (via drill 0.3)  (1 unrouted)
  Top 0.254: ZU4.21 21.16,14.05 | J1.GND1 35.1,4.27 35.56,3.81
  Top 0.305: 19.53,13.69 19.89,14.05 21.16,14.05 22.02,14.05 22.28,13.79 23.33,13.79
  Top 0.406: ZU4.5 12.5,13.26 11.21,13.26 | 23.33,13.79 25.7,13.79 C11.2
  other vias: 22.86,15.24 24.28,9.12 11.43,8.89 24.18,17.07 23.06,3.99 31.34,7.06 35.56,8.2 39.85,10.06 39.27,17.96 38.84,5.46 10.95,13.51 15.14,22.15 55.65,8.69 59.61,4.67
  pour Top: 0,0 0,82.95 93,82.95 93,0
  pour Bottom: 94,0 93,82.95 0,82.95 0,0
N$2
  Top 0.406: C1.2 44.23,15.34 43.3,16.27 Q1.2 42.32,16.23 42.32,13.84 41.33,12.85 37.59,12.85 36.98,12.23 U2.7
N$3
  Bottom 0.254: U1.28 69.71,8.12 70.33,8.74 71.98,8.74 72.34,9.09 C23.2
N$4
  Top 0.406: C2.2 44.34,12.31 43.43,11.4 42.38,11.4 Q1.1 42.07,11.15 U2.8
N$5  (via drill 0.3)
  Top 0.305: TP3.TP 36.42,18.95 v35.53,18.06 | U2.13 33.17,16.54 v33.17,15.14 28.85,15.14 27.96,16.03 C3.2
  Bottom 0.305: v35.53,18.06 35.53,17.5 v33.17,15.14
N$6
  Top 0.254: C4.1 28.1,11.59 30,13.49 | U2.4 33.16,12.24 33.18,12.25
  Top 0.305: 30,13.49 31.74,13.49 32.23,13.01 32.77,13.01 33.16,12.61 33.16,12.24
  Top 0.406: C4.1
N$7
  Top 0.254: R3.1 LED1.A
N$10
  Top 0.305: J1.VBUS1 32.5,8.36 F1.2
N$11
  Bottom 0.254: U1.2 51.51,8.1 50.6,9.02 C34.2
N$19
  Bottom 0.254: U1.27 69.01,8.13 69.95,9.07 C22.2
N$104
  Bottom 0.254: U1.26 68.31,8.22 67.54,8.99 R9.1
N$112  (via drill 0.3)
  Top 0.254: v51.82,8.94 51.82,12.6 v50.6,13.82
  Bottom 0.254: U1.3 52.21,8.55 v51.82,8.94 | v50.6,13.82 C34.1
N$113
  Bottom 0.254: U1.4 52.91,8.66 52.58,8.99 C35.2
N$114
  Bottom 0.254: U1.5 53.61,9.16 53.77,9.32 53.77,11.79 53.39,12.17 52.59,12.17 C35.1
RESET  (via drill 0.3)
  Top 0.254: RESET.2 19.84,5.77 v21.26,7.19 21.67,7.59 21.67,8.94 v22.05,9.32 | ZU4.29 16.43,16.85 v17.27,16 | R8.1 25.12,7.34 v24.79,7.01
  Top 0.305: C3.1 v24.21,16.03 | ZU4.29 16.38,18.04 | ICSP.5 18.45,2.87 RESET.2
  Top 0.813: C3.1
  Bottom 0.254: v22.05,9.32 23.24,9.32 24.69,10.77 24.69,15.54 | v17.27,16 24.18,16 v24.21,16.03 | v24.79,7.01 24.43,7.37 21.44,7.37 v21.26,7.19
  Bottom 0.305: 24.69,15.54 v24.21,16.03
RST  (1 unrouted)
  Bottom 0.254: U1.14 59.91,8.22 60.2,8.51 62.08,8.51 62.43,8.87 62.74,8.87 62.92,9.04 R17.1
SCL_3V3  (via drill 0.3)
  Top 0.305: v60.63,14.68 v60.63,9.14 61.67,8.1 v62.69,8.1
  Bottom 0.305: Q4.2 62.78,16.83 v60.63,14.68 | v62.69,8.1 62.69,6.44 U1.18 | R11.1 v60.63,9.14
SDA_3V3  (via drill 0.3)
  Top 0.305: v62.03,17.32 62.03,11.79 v65.01,8.8
  Bottom 0.305: U1.19 U1.20 64.11,7.9 64.63,8.42 v65.01,8.8 65.2,8.99 R19.1 | Q3.2 61.53,16.83 v62.03,17.32
VCC  (via drill 0.3)
  Top 0.254: C4.2 25.72,12.38 26.04,12.7 27.3,12.7 27.62,13.02 C11.1 | C11.1 | C11.1 29.3,13.81 v29.46,13.97 | ZU4.18 21.14,11.68 | v39.23,6.92 C14.1
  Top 0.305: C6.2 23.36,11.69 | R8.2 27.79,7.72 v28.41,8.34 | C9.2 71.09,48.35 71.12,48.39 | C8.2 48.24,48.43 48.26,48.41 | C7.2 21.68,49.62 21.59,49.53 20.78,49.53 20.55,49.3 | C5.2 7.95,49.62 ZX1.7
  Top 0.406: ZU4.18 v19.74,11.69 | ZU4.4 12.58,14.05 v13.79,14.05 | 21.14,11.68 23.31,11.68 C6.2 | 23.36,11.69 25.62,11.69 C4.2
  Top 0.61: U6.1 v39.23,6.92 v39.22,6.91 | ZX1.7 7.98,49.66 9.91,49.66 11.15,48.41 19.66,48.41 20.55,49.3 20.89,49.64 ZX2.7 36.21,49.64 37.44,48.41 48.26,48.41 49.28,48.41 50.52,49.66 52.61,49.66 ZX3.7 58.56,49.64 59.82,48.39 71.12,48.39 71.5,48.39 72.75,49.63 74.79,49.63 ZX4.7
  Top 0.813: F1.1 29.47,8.4 v29.46,8.39 | U2.16 29.36,17.75 v29.46,17.86 29.46,28.96 27.94,30.48 v27.94,34.29
  Bottom 0.406: v19.74,11.69 17.39,14.05 v13.79,14.05
  Bottom 0.61: v39.22,6.91 33.17,6.91 32.21,5.94 30.48,5.94 29.46,6.96 v29.46,8.39 | ICSP.2 10.7,5.41 14.28,8.99 20.34,8.99 21.18,8.15 28.22,8.15 v28.41,8.34 29.46,9.4
  Bottom 0.813: v29.46,8.39 29.46,9.4 v29.46,13.97 v29.46,17.86 | v27.94,34.29 27.94,48.26 29.21,49.53 30.34,49.53 ZX2.7 | R10.2 R13.2 46.45,10.86 42.52,6.93 39.24,6.93 v39.22,6.91
XTAL1
  Top 0.406: C12.2 6.85,15.13 Q2.1 7.96,14.27 10.54,11.69 ZU4.7
XTAL2
  Top 0.406: C13.2 6.96,12.4 Q2.2 8.47,10.89 ZU4.8

### Text on the board
tNames: # | 1
bNames: | UNO | More info on: / dramco.be/dramco-uno / by Guus Leenders | Engineering Tech / Electronics / ICT / Campus Ghent
214bmp: D:/SmartProjects/Snc/a4_bn_logo2.bmp